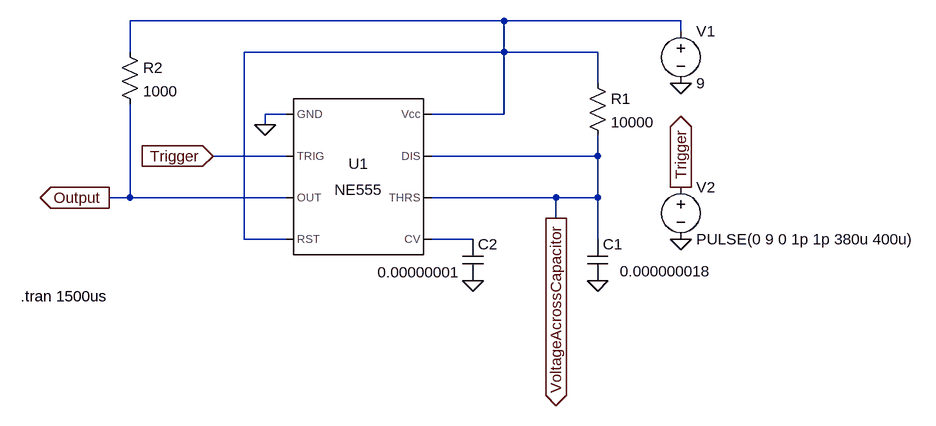
[diagram p0: schematic Monostable_Multi-Vibrator.asc]
Monostable_Multi-Vibrator.asc, the LTspice schematic file:
Version 4
SHEET 1 1056 680
WIRE 384 -64 -192 -64
WIRE 656 -64 384 -64
WIRE 656 -48 656 -64
WIRE -192 -16 -192 -64
WIRE 384 -16 384 -64
WIRE 384 -16 -16 -16
WIRE 528 -16 384 -16
WIRE 528 32 528 -16
WIRE 48 80 16 80
WIRE 384 80 384 -16
WIRE 384 80 272 80
WIRE 16 96 16 80
WIRE 48 144 -64 144
WIRE 528 144 528 112
WIRE 528 144 272 144
WIRE -192 208 -192 64
WIRE -192 208 -224 208
WIRE 48 208 -192 208
WIRE 464 208 272 208
WIRE 528 208 528 144
WIRE 528 208 464 208
WIRE 464 240 464 208
WIRE -16 272 -16 -16
WIRE 48 272 -16 272
WIRE 336 272 272 272
WIRE 528 272 528 208
FLAG 528 336 0
FLAG 336 336 0
FLAG 16 96 0
FLAG -224 208 Output
IOPIN -224 208 Out
FLAG 656 192 Trigger
IOPIN 656 192 Out
FLAG 656 32 0
FLAG 656 272 0
FLAG -64 144 Trigger
IOPIN -64 144 In
FLAG 464 240 VoltageAcrossCapacitor
IOPIN 464 240 Out
SYMBOL Misc\\NE555 160 176 R0
SYMATTR InstName U1
SYMBOL res 512 16 R0
SYMATTR InstName R1
SYMATTR Value 10000
SYMATTR SpiceLine tol=1 pwr=0.1
SYMBOL cap 512 272 R0
WINDOW 3 50 49 Left 2
SYMATTR Value 0.000000018
SYMATTR InstName C1
SYMBOL cap 320 272 R0
WINDOW 3 -131 51 Left 2
SYMATTR Value 0.00000001
SYMATTR InstName C2
SYMBOL res -208 -32 R0
SYMATTR InstName R2
SYMATTR Value 1000
SYMATTR SpiceLine tol=1 pwr=0.1
SYMBOL voltage 656 -64 R0
WINDOW 123 0 0 Left 0
WINDOW 39 0 0 Left 0
SYMATTR InstName V1
SYMATTR Value 9
SYMBOL voltage 656 176 R0
WINDOW 123 0 0 Left 0
WINDOW 39 0 0 Left 0
SYMATTR InstName V2
SYMATTR Value PULSE(0 9 0 1p 1p 380u 400u)
TEXT -360 360 Left 2 !.tran 1500us

The netlist it stands for:
* Monostable_Multi-Vibrator.asc
XU1 0 Trigger Output N001 N002 VoltageAcrossCapacitor VoltageAcrossCapacitor N001 NE555  ; pins GND TRIG OUT RST CV THRS DIS Vcc
R1 N001 VoltageAcrossCapacitor 10000 tol=1 pwr=0.1
C1 VoltageAcrossCapacitor 0 0.000000018
C2 N002 0 0.00000001
R2 N001 Output 1000 tol=1 pwr=0.1
V1 N001 0 9
V2 Trigger 0 PULSE(0 9 0 1p 1p 380u 400u)
.tran 1500us
.lib NE555.sub
.backanno
.end